# Altium project MachNguon.PrjPcb
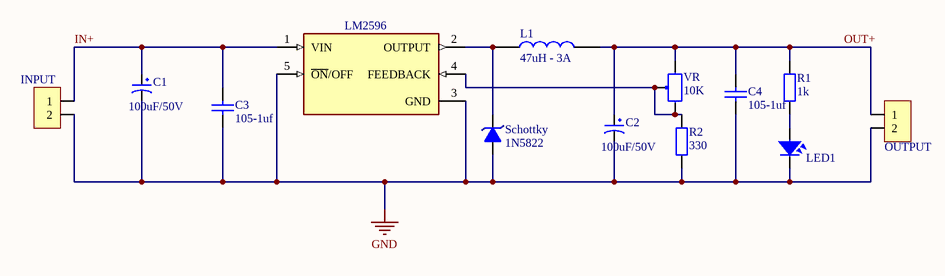
[diagram p0: Sheet1.SchDoc]
1 sheet, 13 parts. Net scope: global (net labels, ports and power ports of the same name join across sheets).
Board file: PCB_nguon.PcbDoc

## Sheet Sheet1.SchDoc
size A; SheetNumber: 1; SheetTotal: 1

### Parts
C1  100uF/50V  [CP1.5/3.4]
C2  100uF/50V  [CP1.5/3.4]
C3  105-1uf  [tu gom]
C4  105-1uf  [tu gom]
INPUT  INPUT  [JP 1x2 DT]  (value not drawn)
L1  47uH - 3A  [CUON CAM 100uH3A]
LED1  LED  [LED-3]  (value not drawn)
LM2596  LM2596-5.0WT  [TO170P1016X444X1572-5]  (value not drawn)
OUTPUT  (no value)  [JP 1x2 DT]
R1  1k  [R1/4W]
R2  330  [R1/4W]
Schottky  1N5822  [D1A]
VR  10K  [Bien Tro Vi Chinh Dung]

### Nets
GND: C1.2 C2.2 C3.2 C4.2 INPUT.2 LED1.2 LM2596.3(GND) LM2596.5(~{ON}/OFF) OUTPUT.2 R2.1 Schottky.1(A)
IN+: C1.1 C3.1 INPUT.1 LM2596.1(VIN)
OUT+: C2.1 C4.1 L1.2 OUTPUT.1 R1.2 VR.3
NetL1_1: L1.1 LM2596.2(OUTPUT) Schottky.2(K)
NetLED1_1: LED1.1 R1.1
NetLM2596_4: LM2596.4(FEEDBACK) R2.2 VR.1 VR.2

### Library data of the parts
C1 C2 = CP3: Cap 100uF/35V - 470uF/16V; Value: 100uF/35V/50V; Description 1: 1000uF/6,3V - 470uF/16V - 330uF - 25V; Description 2: 220uF/35V - 100uF/50V - 63V - 4,7uF/200V; Description 3: 22uF => 33uF100V - 3,3uF => 4,7uF/250V; Description 4: 2,2uF =>3,3uF/350 - 2,2uF/400V - 1uF/450V
C3 C4 = Tu gom 104 50V: Cắm; So_Chan: 2; Ten_Linh_Kien: Tụ gốm 104 100nF 50V; Don_Vi: Con; Ma_Hang: MH004761; Chung_Loai: Cắm; Kieu_Chan: *
INPUT OUTPUT = JP 1x2 2.54 Duc Thang: Cắm; Ten_Linh_Kien: Jump Đơn Đực 2.54MM 1x40P Thẳng 11MM; Don_Vi: Con; Ma_Hang: MH000903; Ghi_Chu: *; Kieu_Chan: *; Chung_Loai: Cắm
L1 = CUON CAM 470uH DIP: Cắm; Don_Vi: Con; Ma_Hang: MH002232; Ten_Linh_Kien: Cuộn Cảm 470uH 3A 8x10MM; Ghi_Chu: *; Kieu_Chan: *; Chung_Loai: Cắm
LED1 = LED: LED Single colour Green and Red; Value: LED 3 ly Single Colour
LM2596 = LM2576-5.0WT: Buck Switching Regulator IC Positive Fixed 5V 1 Output 3A TO-220-5; MF: Microchip; SnapEDA_Link: https://www.snapeda.com/parts/LM2576-5.0WT/Microchip/view-part/?ref=snap; Package: TO-220 Microchip; Value: *; MP: LM2576-5.0WT; Check_prices: https://www.snapeda.com/parts/LM2576-5.0WT/Microchip/view-part/?ref=eda
R1 R2 = R1/4W: Resistor 1/4W; Value: R1/4W - 1K
Schottky = Zener
VR = Bien Tro Tinh Chinh 10K Dung: Cắm; Ma_Hang: MH003232; Ten_Linh_Kien: Biến Trở VR 103-10K 3296W; Don_Vi: Con; Kieu_Chan: *; Chung_Loai: Cắm; Ghi_Chu: *